# Altium schematic sheet pmic_bq25690_battcharger.SchDoc
size B
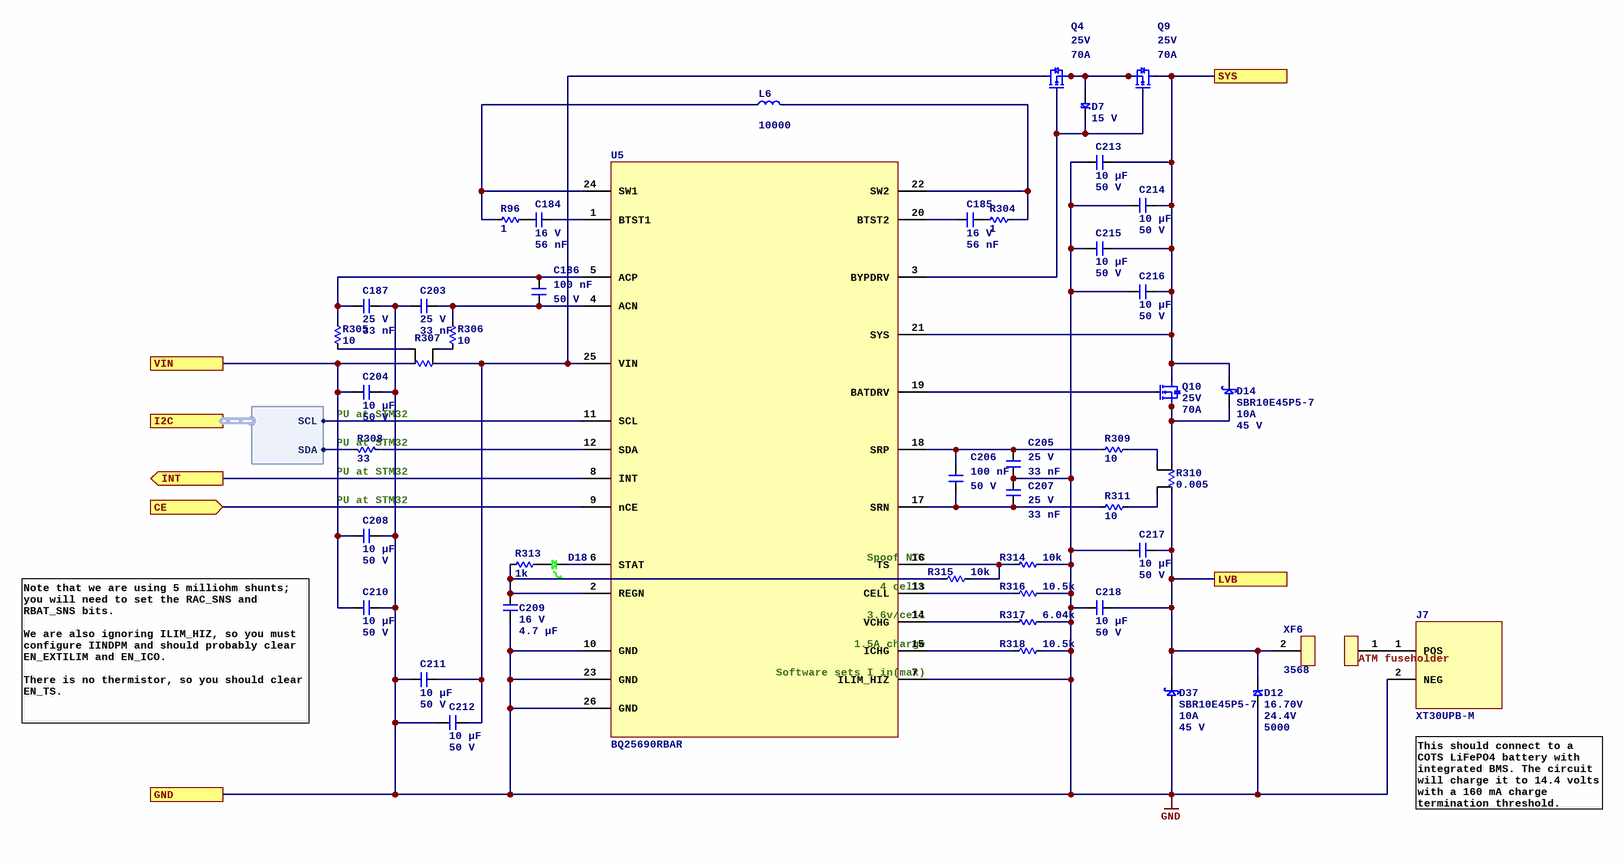
[diagram p0: pmic_bq25690_battcharger.SchDoc]

## Parts
C184  Voltage Rating: 16 V  Capacitance: 56 nF  [C0402]  (hidden comment: CC0402KRX7R7BB563)
C185  Voltage Rating: 16 V  Capacitance: 56 nF  [C0402]  (hidden comment: CC0402KRX7R7BB563)
C186  Capacitance: 100 nF  Voltage Rating: 50 V  [C0402]  (hidden comment: CL05B104KB54PNC)
C187  Voltage Rating: 25 V  Capacitance: 33 nF  [C0402]  (hidden comment: 0402B333K250NT)
C203  Voltage Rating: 25 V  Capacitance: 33 nF  [C0402]  (hidden comment: 0402B333K250NT)
C204  Capacitance: 10 µF  Voltage Rating: 50 V  [C1206]  (hidden comment: CL31B106KBHNNNE)
C205  Voltage Rating: 25 V  Capacitance: 33 nF  [C0402]  (hidden comment: 0402B333K250NT)
C206  Capacitance: 100 nF  Voltage Rating: 50 V  [C0402]  (hidden comment: CL05B104KB54PNC)
C207  Voltage Rating: 25 V  Capacitance: 33 nF  [C0402]  (hidden comment: 0402B333K250NT)
C208  Capacitance: 10 µF  Voltage Rating: 50 V  [C1206]  (hidden comment: CL31B106KBHNNNE)
C209  Voltage Rating: 16 V  Capacitance: 4.7 µF  [C0603]  (hidden comment: GRM188Z71C475KE21D)
C210  Capacitance: 10 µF  Voltage Rating: 50 V  [C1206]  (hidden comment: CL31B106KBHNNNE)
C211  Capacitance: 10 µF  Voltage Rating: 50 V  [C1206]  (hidden comment: CL31B106KBHNNNE)
C212  Capacitance: 10 µF  Voltage Rating: 50 V  [C1206]  (hidden comment: CL31B106KBHNNNE)
C213  Capacitance: 10 µF  Voltage Rating: 50 V  [C1206]  (hidden comment: CL31B106KBHNNNE)
C214  Capacitance: 10 µF  Voltage Rating: 50 V  [C1206]  (hidden comment: CL31B106KBHNNNE)
C215  Capacitance: 10 µF  Voltage Rating: 50 V  [C1206]  (hidden comment: CL31B106KBHNNNE)
C216  Capacitance: 10 µF  Voltage Rating: 50 V  [C1206]  (hidden comment: CL31B106KBHNNNE)
C217  Capacitance: 10 µF  Voltage Rating: 50 V  [C1206]  (hidden comment: CL31B106KBHNNNE)
C218  Capacitance: 10 µF  Voltage Rating: 50 V  [C1206]  (hidden comment: CL31B106KBHNNNE)
D7  Vr: 15 V  [SOD323]  (hidden comment: MM3Z15VC)
D12  Min Breakdown Voltage: 16.70V  Clamping Voltage-Max: 24.4V  Power (W): 5000  [SMC]  (hidden comment: 5.0SMDJ15A)
D14  SBR10E45P5-7  Current: 10A  Vr: 45 V  [POWERDI5]
D18  LTST-C190GKT  [LED_0603P_GREEN]  (value not drawn)
D37  SBR10E45P5-7  Current: 10A  Vr: 45 V  [POWERDI5]
J7  XT30UPB-M  [AMASS_XT30UPB-M]
L6  Current Rating (mA): 10000  [BOURNS_SRP1265A]  (hidden comment: SRP1265A-100M)
Q4  Voltage: 25V  Current: 70A  [SOT1210]  (hidden comment: PSMN2R0-25MLDX)
Q9  Voltage: 25V  Current: 70A  [SOT1210]  (hidden comment: PSMN2R0-25MLDX)
Q10  Voltage: 25V  Current: 70A  [SOT1210]  (hidden comment: PSMN2R0-25MLDX)
R96  value 1  [R0402]  (hidden comment: CRCW04021R00FKED)
R304  value 1  [R0402]  (hidden comment: CRCW04021R00FKED)
R305  value 10  [R0402]  (hidden comment: FRC0402F10R0TS)
R306  value 10  [R0402]  (hidden comment: FRC0402F10R0TS)
R307  WSL27265L000FEB  [VISHAY_WSL2726]  (value not drawn)
R308  value 33  [R0402]  (hidden comment: 0402WGF330JTCE)
R309  value 10  [R0402]  (hidden comment: FRC0402F10R0TS)
R310  value 0.005  [VISHAY_WSL2726]  (hidden comment: WSL27265L000FEB)
R311  value 10  [R0402]  (hidden comment: FRC0402F10R0TS)
R313  value 1k  [R0402]  (hidden comment: 0402WGF1001TCE)
R314  value 10k  [R0402]  (hidden comment: 0402WGF1002TCE)
R315  value 10k  [R0402]  (hidden comment: 0402WGF1002TCE)
R316  value 10.5k  [R0402]  (hidden comment: 0402WGF1052TCE)
R317  value 6.04k  [R0402]  (hidden comment: 0402WGF6041TCE)
R318  value 10.5k  [R0402]  (hidden comment: 0402WGF1052TCE)
U5  BQ25690RBAR  [TI_RBA]
XF6  3568  [FUSEHOLDER_KEYSTONE_3568]

## Ports
CE (in), GND, I2C (harness I2C), INT (out), LVB, SYS, VIN

## Harnesses
I2C: SCL, SDA

## Nets
GND: C187.2 C203.1 C204.2 C205.1 C207.2 C208.2 C209.1 C210.2 C211.2 C212.2 C213.2 C214.2 C215.2 C216.2 C217.2 C218.2 D12.1 D37.1 J7.2(NEG) R314.1 R316.1 R317.1 R318.1 U5.7(ILIM_HIZ) U5.10(GND) U5.23(GND) U5.26(GND) ; port GND
CE: U5.9(nCE) ; port CE
INT: U5.8(INT) ; port INT
LVB: C217.1 C218.1 D12.2 D37.2 R310.2 XF6.2 ; port LVB
SYS: C213.1 C214.1 C215.1 C216.1 D14.2 Q9.5 Q10.5 U5.21(SYS) ; port SYS
VIN: C204.1 C208.1 C210.1 R307.2 ; port VIN
NetC184_1: C184.1 R96.2
NetC184_2: C184.2 U5.1(BTST1)
NetC185_1: C185.1 U5.20(BTST2)
NetC185_2: C185.2 R304.1
NetC186_1: C186.1 C187.1 R305.2 U5.5(ACP)
NetC186_2: C186.2 C203.2 R306.2 U5.4(ACN)
NetC205_2: C205.2 C206.1 R309.2 U5.18(SRP)
NetC206_2: C206.2 C207.1 R311.2 U5.17(SRN)
NetC209_2: C209.2 R313.1 R315.2 U5.2(REGN)
NetC211_1: C211.1 C212.1 Q4.5 R307.1 U5.25(VIN)
NetD7_1: D7.1 Q4.1 Q4.2 Q4.3 Q9.1 Q9.2 Q9.3
NetD7_2: D7.2 Q4.4 Q9.4 U5.3(BYPDRV)
NetD14_1: D14.1 Q10.1 Q10.2 Q10.3 R310.1
NetD18_1: D18.1 R313.2
NetD18_2: D18.2 U5.6(STAT)
NetJ7_1: J7.1(POS) XF6.1
NetL6_1: L6.1 R96.1 U5.24(SW1)
NetL6_2: L6.2 R304.2 U5.22(SW2)
NetQ10_4: Q10.4 U5.19(BATDRV)
NetR305_1: R305.1 R307.4
NetR306_1: R306.1 R307.3
NetR308_1: R308.1 ; port I2C.SDA
NetR308_2: R308.2 U5.12(SDA)
NetR309_1: R309.1 R310.3
NetR310_4: R310.4 R311.1
NetR314_2: R314.2 R315.1 U5.16(TS)
NetR316_2: R316.2 U5.13(CELL)
NetR317_2: R317.2 U5.14(VCHG)
NetR318_2: R318.2 U5.15(ICHG)
NetU5_11: U5.11(SCL) ; port I2C.SCL

## Notes on the sheet
- PU at STM32
- (near R308) PU at STM32
- (near R315) 4 cells
- (near R315) Spoof NTC
- 3.6v/cell
- 1.5A charge
- Software sets I_in(max)
- Note that we are using 5 milliohm shunts; you will need to set the RAC_SNS and RBAT_SNS bits.
  We are also ignoring ILIM_HIZ, so you must configure IINDPM and should probably clear EN_EXTILIM and EN_ICO.
  There is no thermistor, so you should clear EN_TS.
- This should connect to a COTS LiFePO4 battery with integrated BMS. The circuit will charge it to 14.4 volts with a 160 mA charge termination threshold.
- (in symbol 3568) ATM fuseholder

## Library data of the parts
C184 C185 = CC0402KRX7R7BB563: Manufacturer: YAGEO; Dielectric: X7R; Manufacturer Part Number: CC0402KRX7R7BB563; Package: 0402; Supplier 2: LCSC; Supplier Part Number 2: C107018; ComponentLink1Description: Datasheet; ComponentLink1URL: https://wmsc.lcsc.com/wmsc/upload/file/pdf/v2/lcsc/2304140030_YAGEO-CC0402KRX7R7BB563_C107018.pdf
C186 C206 = CL05B104KB54PNC: Manufacturer: Samsung Electro-Mechanics; Dielectric: X7R; ComponentLink1URL: https://wmsc.lcsc.com/wmsc/upload/file/pdf/v2/lcsc/2304140030_Samsung-Electro-Mechanics-CL05B104KB54PNC_C307331.pdf; ComponentLink1Description: Datasheet; Manufacturer Part Number: CL05B104KB54PNC; Package: 0402; Supplier 2: LCSC; Supplier Part Number 2: C307331
C187 C203 C205 C207 = 0402B333K250NT: Manufacturer: FH (Guangdong Fenghua Advanced Tech); Dielectric: X7R; Manufacturer Part Number: 0402B333K250NT; Package: 0402; Supplier 2: LCSC; Supplier Part Number 2: C285174; ComponentLink1Description: Datasheet; ComponentLink1URL: https://datasheet.lcsc.com/lcsc/2110191430_FH--Guangdong-Fenghua-Advanced-Tech-0402B333K250NT_C285174.pdf
C204 C208 C210-C218 = CL31B106KBHNNNE: Manufacturer: Samsung Electro-Mechanics; Dielectric: X7R; ComponentLink1URL: https://wmsc.lcsc.com/wmsc/upload/file/pdf/v2/lcsc/1810221111_Samsung-Electro-Mechanics-CL31B106KBHNNNE_C89632.pdf; ComponentLink1Description: Datasheet; Manufacturer Part Number: CL31B106KBHNNNE; Package: 1206; Supplier 2: LCSC; Supplier Part Number 2: C89632
C209 = GRM188Z71C475KE21D: Manufacturer: Murata Electronics; Dielectric: X7R; Manufacturer Part Number: GRM188Z71C475KE21D; Package: 0603; Supplier 2: LCSC; Supplier Part Number 2: C389010; ComponentLink1Description: Datasheet; ComponentLink1URL: https://wmsc.lcsc.com/wmsc/upload/file/pdf/v2/lcsc/1912111437_Murata-Electronics-GRM188Z71C475KE21D_C389010.pdf
D7 = MM3Z15VC: DIODE ZENER 15V 200MW SOD; Manufacturer: onsemi; Current: 13.3 mA; Supplier 1: DigiKey; Manufacturer Part Number: MM3Z15VC; ComponentLink1URL: https://www.onsemi.com/pdf/datasheet/mm3z9v1c-d.pdf; ComponentLink1Description: Datasheet; Supplier Part Number 1: MM3Z15VCCT-ND; Supplier 2: LCSC; Supplier Part Number 2: C891582; Diode Type: Zener; Supplier 3: Mouser; Supplier Part Number 3: 512-MM3Z15VC
D12 = 5.0SMDJ15A: TVS DIODE 15VWM 24.4VC DO214AB; Manufacturer: Bourns Inc.; Polarity: Unidirectional; Standoff (V): 15; ComponentLink1URL: https://www.bourns.com/docs/product-datasheets/5-0smdj.pdf; ComponentLink1Description: Datasheet; Supplier 1: DigiKey; Supplier Part Number 1: 5.0SMDJ15ABBCT-ND; Manufacturer Part Number: 5.0SMDJ15A; Supplier 2: LCSC; Supplier Part Number 2: C3707853; Supplier 3: Mouser; Supplier Part Number 3: 652-5.0SMDJ15A
D14 D37 = SBR10E45P5-7: Rectifier Diode, 1 Phase, 1 Element, 10A, 45V V(RRM), Silicon; Manufacturer: Diodes; Diode Type: Schottky; Supplier 1: DigiKey; Supplier Part Number 1: SBR10E45P5-7DICT-ND; Manufacturer Part Number: SBR10E45P5-7; ComponentLink1Description: Datasheet; ComponentLink1URL: https://www.diodes.com/assets/Datasheets/SBR10E45P5.pdf; Supplier 2: LCSC; Supplier Part Number 2: C73569; Supplier 3: Mouser; Supplier Part Number 3: 621-SBR10E45P5-7
D18 = LTST-C190GKT: LED GREEN CLEAR 0603 SMD; Manufacturer: Lite-On Inc; Vf: 2.0 V; If: 20 mA; Supplier 1: DigiKey; ComponentLink1URL: https://mm.digikey.com/Volume0/opasdata/d220001/medias/docus/858/LTST-C190GKT.pdf; ComponentLink1Description: Datasheet; Supplier Part Number 1: 160-1183-1-ND; Manufacturer Part Number: LTST-C190GKT; Supplier 2: LCSC; Supplier Part Number 2: C125093; LED Color: Green; Supplier 3: Mouser; Supplier Part Number 3: 859-LTST-C190GKT
J7 = XT30UPB-M: Vertical PCB mount XT30 male; Manufacturer: Changzhou Amass Elec; Manufacturer Part Number: XT30UPB-M; ComponentLink1Description: Datasheet; ComponentLink1URL: https://www.tme.com/Document/1191bc2fa3aee3c446e5a895fd8f7983/XT60PW-F.pdf; Supplier 2: LCSC; Supplier Part Number 2: C428721
L6 = SRP1265A-100M: 10 µH shielded power inductor; Manufacturer: BOURNS; DCR (mOhms): 16.5; Inductance (µH): 10; Manufacturer Part Number: SRP1265A-100M; Supplier 1: DigiKey; Supplier Part Number 1: SRP1265A-100MCT-ND; Supplier 2: LCSC; Supplier Part Number 2: C840531; ComponentLink1Description: Datasheet; ComponentLink1URL: https://www.bourns.com/docs/Product-Datasheets/SRP1265A.pdf; Supplier 3: Mouser; Supplier Part Number 3: 652-SRP1265A-100M
Q4 Q9 Q10 = PSMN2R0-25MLDX: N-Channel 25 V 70A (Tc) 74W (Tc) Surface Mount LFPAK33; Manufacturer: Nexperia; Supplier 1: DigiKey; Supplier Part Number 1: 1727-2501-1-ND; Manufacturer Part Number: PSMN2R0-25MLDX; Supplier 2: LCSC; Supplier Part Number 2: C553243; ComponentLink1Description: Datasheet; ComponentLink1URL: https://assets.nexperia.com/documents/data-sheet/PSMN2R0-25MLD.pdf; Channel Type: N-channel; Supplier 3: Mouser; Supplier Part Number 3: 771-PSMN2R0-25MLDX
R96 R304 = CRCW04021R00FKED: Manufacturer: Vishay Intertech; Power Rating (mW): 63; Tolerance: 1%; Temperature Coefficient: ±100ppm/?; Manufacturer Part Number: CRCW04021R00FKED; Package: 0402; Supplier 2: LCSC; Supplier Part Number 2: C482087; ComponentLink1Description: Datasheet; ComponentLink1URL: https://wmsc.lcsc.com/wmsc/upload/file/pdf/v2/lcsc/2211030200_Vishay-Intertech-CRCW04021R00FKED_C482087.pdf
R305 R306 R309 R311 = FRC0402F10R0TS: Manufacturer: FOJAN; Power Rating (mW): 62.5; Tolerance: 1%; Temperature Coefficient: ±100ppm/?; Manufacturer Part Number: FRC0402F10R0TS; Package: 0402; Supplier 2: LCSC; Supplier Part Number 2: C2906862; ComponentLink1Description: Datasheet; ComponentLink1URL: https://datasheet.lcsc.com/lcsc/2308241947_FOJAN-FRC0402F10R0TS_C2906862.pdf
R307 = WSL27265L000FEB: Manufacturer: Vishay Dale; Value: 0.005; Tolerance: 1%; Power Rating (mW): 3000; Supplier 1: DigiKey; Manufacturer Part Number: WSL27265L000FEB; ComponentLink1URL: http://www.vishay.com/docs/30131/wsl2726.pdf; ComponentLink1Description: Datasheet; Supplier Part Number 1: WSLQ-.005CT-ND; Supplier 2: LCSC; Supplier Part Number 2: C1517421; Package: 2726
R308 = 0402WGF330JTCE: Manufacturer: UNI-ROYAL(Uniroyal Elec); Tolerance: 1%; Temperature Coefficient: ±100ppm/?; Power Rating (mW): 62.5; ComponentLink1Description: Datasheet; ComponentLink1URL: https://wmsc.lcsc.com/wmsc/upload/file/pdf/v2/lcsc/2205311900_UNI-ROYAL-Uniroyal-Elec-0402WGF330JTCE_C25105.pdf; Manufacturer Part Number: 0402WGF330JTCE; Package: 0402; Supplier 2: LCSC; Supplier Part Number 2: C25105
R310 = WSL27265L000FEB: Manufacturer: Vishay Dale; Tolerance: 1%; Power Rating (mW): 3000; Supplier 1: DigiKey; Manufacturer Part Number: WSL27265L000FEB; ComponentLink1URL: http://www.vishay.com/docs/30131/wsl2726.pdf; ComponentLink1Description: Datasheet; Supplier Part Number 1: WSLQ-.005CT-ND; Supplier 2: LCSC; Supplier Part Number 2: C1517421; Package: 2726
R313 = 0402WGF1001TCE: Manufacturer: UNI-ROYAL(Uniroyal Elec); Tolerance: 1%; Temperature Coefficient: ±100ppm/?; Power Rating (mW): 62.5; ComponentLink1Description: Datasheet; ComponentLink1URL: https://wmsc.lcsc.com/wmsc/upload/file/pdf/v2/lcsc/2206010216_UNI-ROYAL-Uniroyal-Elec-0402WGF1001TCE_C11702.pdf; Manufacturer Part Number: 0402WGF1001TCE; Package: 0402; Supplier 2: LCSC; Supplier Part Number 2: C11702
R314 R315 = 0402WGF1002TCE: Manufacturer: UNI-ROYAL(Uniroyal Elec); Power Rating (mW): 62.5; Tolerance: 1%; Temperature Coefficient: ±100ppm/?; Manufacturer Part Number: 0402WGF1002TCE; Package: 0402; Supplier 2: LCSC; Supplier Part Number 2: C25744; ComponentLink1Description: Datasheet; ComponentLink1URL: https://wmsc.lcsc.com/wmsc/upload/file/pdf/v2/lcsc/2206010100_UNI-ROYAL-Uniroyal-Elec-0402WGF1002TCE_C25744.pdf
R316 R318 = 0402WGF1052TCE: Manufacturer: UNI-ROYAL(Uniroyal Elec); Power Rating (mW): 62.5; Tolerance: 1%; Temperature Coefficient: ±100ppm/?; Manufacturer Part Number: 0402WGF1052TCE; Package: 0402; Supplier 2: LCSC; Supplier Part Number 2: C25850; ComponentLink1Description: Datasheet; ComponentLink1URL: https://wmsc.lcsc.com/wmsc/upload/file/pdf/v2/lcsc/2206010045_UNI-ROYAL-Uniroyal-Elec-0402WGF1052TCE_C25850.pdf
R317 = 0402WGF6041TCE: Manufacturer: UNI-ROYAL(Uniroyal Elec); Power Rating (mW): 62.5; Tolerance: 1%; Temperature Coefficient: ±100ppm/?; Manufacturer Part Number: 0402WGF6041TCE; Package: 0402; Supplier 2: LCSC; Supplier Part Number 2: C25913; ComponentLink1Description: Datasheet; ComponentLink1URL: https://wmsc.lcsc.com/wmsc/upload/file/pdf/v2/lcsc/2206010045_UNI-ROYAL-Uniroyal-Elec-0402WGF6041TCE_C25913.pdf
U5 = BQ25690RBAR: Charger IC Lithium Ion/Polymer 26-WQFN-HR (4x3.5); Manufacturer: Texas Instruments; Supplier 1: DigiKey; Supplier Part Number 1: 296-BQ25690RBARCT-ND; Manufacturer Part Number: BQ25690RBAR; ComponentLink1Description: Datasheet; ComponentLink1URL: https://www.ti.com/lit/ds/symlink/bq25690.pdf; Supplier 2: LCSC; Supplier Part Number 2: C53283868; Supplier 3: Mouser; Supplier Part Number 3: 595-BQ25690RBAR
XF6 = 3568: Fuse Holder 30 A 500V 1 Circuit Blade Through Hole; Manufacturer: Keystone Electronics; Supplier 1: DigiKey; Supplier Part Number 1: 36-3568-ND; Manufacturer Part Number: 3568; ComponentLink1URL: https://www.keyelco.com/userAssets/file/M65p42.pdf; ComponentLink1Description: Datasheet; Supplier 2: LCSC; Supplier Part Number 2: C3206956; Supplier 3: Mouser; Supplier Part Number 3: 534-3568